# EAGLE design AutoISP328 (EAGLE 7.2.0)
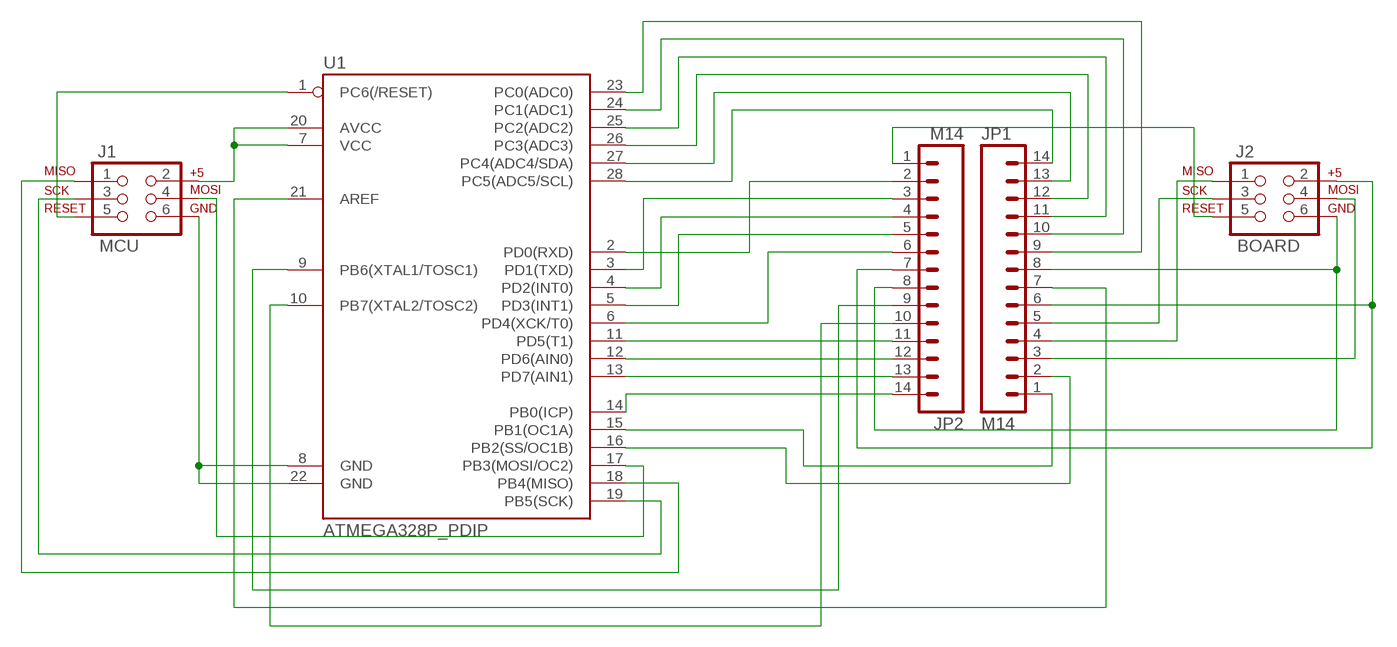
[diagram p0: schematic, sheet 1]

## Parts
J1  MCU  AVR_SPI_PRG_6PTH  [2X3]
J2  BOARD  AVR_SPI_PRG_6PTH  [2X3]
JP1  M14  [1X14]
JP2  M14  [1X14]
U1  ATMEGA328P_PDIP  [DIL28-3]

## Nets
N$1: J1.5 U1.1(PC6(/RESET))
N$2: J1.2 U1.7(VCC) U1.20(AVCC)
N$3: J1.6 U1.8(GND) U1.22(GND)
N$4: J1.4 U1.17(PB3(MOSI/OC2))
N$5: J1.1 U1.18(PB4(MISO))
N$6: J1.3 U1.19(PB5(SCK))
N$8: J2.3 JP1.5
N$9: J2.1 JP1.4
N$10: J2.6 JP1.8 JP2.8
N$11: JP1.14 U1.28(PC5(ADC5/SCL))
N$12: J2.4 JP1.3
N$13: J2.2 JP1.6 JP2.7
N$14: J2.5 JP2.1
N$15: JP1.7 U1.21(AREF)
N$16: JP2.9 U1.9(PB6(XTAL1/TOSC1))
N$17: JP2.10 U1.10(PB7(XTAL2/TOSC2))
N$18: JP1.13 U1.27(PC4(ADC4/SDA))
N$19: JP1.12 U1.26(PC3(ADC3))
N$20: JP1.11 U1.25(PC2(ADC2))
N$21: JP1.10 U1.24(PC1(ADC1))
N$22: JP1.9 U1.23(PC0(ADC0))
N$23: JP2.2 U1.2(PD0(RXD))
N$24: JP2.3 U1.3(PD1(TXD))
N$25: JP2.4 U1.4(PD2(INT0))
N$26: JP2.5 U1.5(PD3(INT1))
N$27: JP2.6 U1.6(PD4(XCK/T0))
N$28: JP2.11 U1.11(PD5(T1))
N$29: JP2.12 U1.12(PD6(AIN0))
N$30: JP2.13 U1.13(PD7(AIN1))
N$31: JP2.14 U1.14(PB0(ICP))
N$32: JP1.1 U1.15(PB1(OC1A))
N$33: JP1.2 U1.16(PB2(SS/OC1B))

## Library data of the parts
J1 J2 = SparkFun-Connectors:AVR_SPI_PRG_6: AVR ISP 6 Pin This is the reduced ISP connector for AVR programming. Common on Arduino. This footprint will take up less PCB space and can be used with a 10-pin to 6-pin adapter such as SKU: BOB-08508
JP1 JP2 = SparkFun-Connectors:M14: Header 14 Standard 14-pin 0.1" header. Use with straight break away headers (SKU : PRT-00116), right angle break away headers (PRT-00553), swiss pins (PRT-00743), machine pins (PRT-00117), and female headers (PRT-00115).
U1 = SparkFun-DigitalIC:ATMEGA328P_PDIP: uC used in the Arduino 32kb flash, 1k EEPROM, 2k SRAM This is the through-hole version of this chip.

## Board
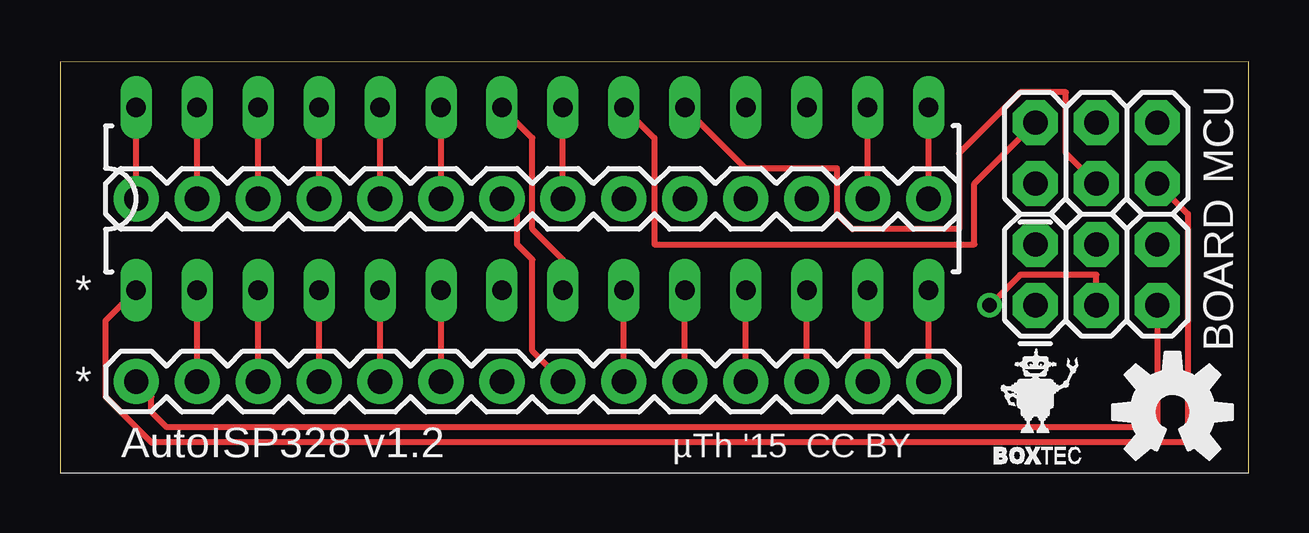
[diagram p1: board, top side]
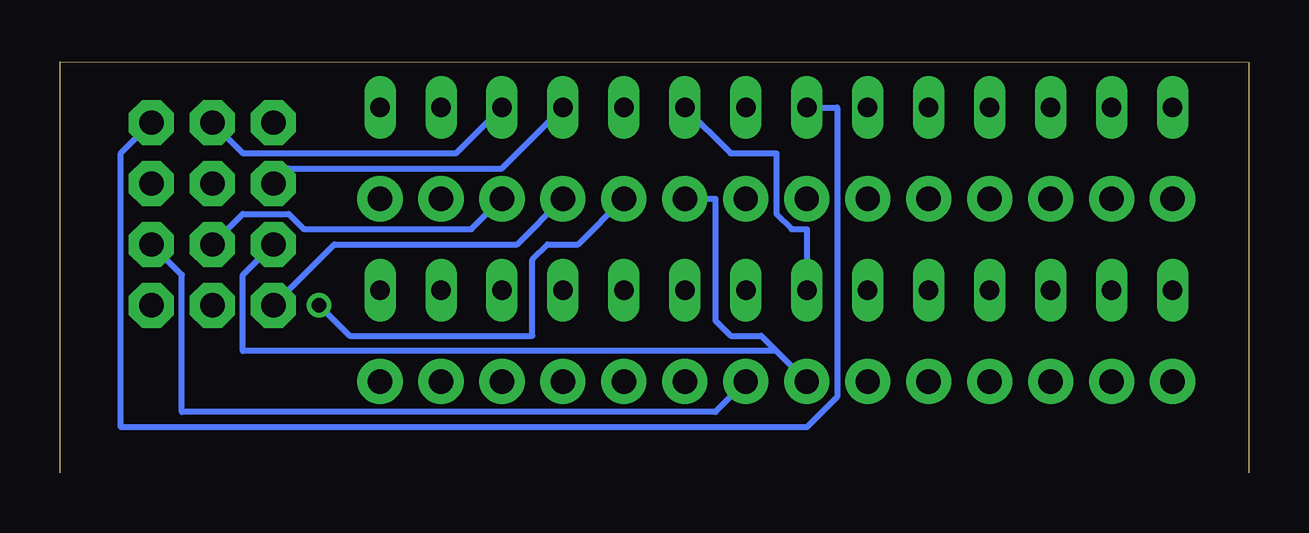
[diagram p2: board, bottom side, seen from below]

Size 49.53 x 17.14 mm. Coordinates in mm from the lower left corner, seen from the top.
Outline: 49.53,0 49.53,17.14 0,17.14 0,0
Copper layers (1*16): Top 0.035mm / dielectric 1.5mm / Bottom 0.035mm
Design rules "default": minimum track width 10mil, minimum drill 24mil, track to track 8mil, track to pad 8mil, pad to pad 8mil, via to via 8mil, smd to smd 8mil, copper to edge 40mil, drill to drill 8mil, minimum pad ring 10mil, minimum via ring 8mil, stop-mask expansion 4mil, vias tented up to drill 0mil, thermal gap 10mil

### Footprints (pad centres in the part's own frame; a part is rotated, then mirrored left to right if it is on the bottom)
2X3 = drill 1.016 pad 1.88 octagon: 1 0,0; 2 0,2.54; 3 2.54,0; 4 2.54,2.54; 5 5.08,0; 6 5.08,2.54
1X14 = drill 1.016 pad 1.88: 1 0,0; 2 2.54,0; 3 5.08,0; 4 7.62,0; 5 10.16,0; 6 12.7,0; 7 15.24,0; 8 17.78,0; 9 20.32,0; 10 22.86,0; 11 25.4,0; 12 27.94,0; 13 30.48,0; 14 33.02,0
DIL28-3 = drill 0.813 long: 1 -16.51,-3.81; 2 -13.97,-3.81; 3 -11.43,-3.81; 4 -8.89,-3.81; 5 -6.35,-3.81; 6 -3.81,-3.81; 7 -1.27,-3.81; 8 1.27,-3.81; 9 3.81,-3.81; 10 6.35,-3.81; 11 8.89,-3.81; 12 11.43,-3.81; 13 13.97,-3.81; 14 16.51,-3.81; 15 16.51,3.81; 16 13.97,3.81; 17 11.43,3.81; 18 8.89,3.81; 19 6.35,3.81; 20 3.81,3.81; 21 1.27,3.81; 22 -1.27,3.81; 23 -3.81,3.81; 24 -6.35,3.81; 25 -8.89,3.81; 26 -11.43,3.81; 27 -13.97,3.81; 28 -16.51,3.81

### Placement (x,y rotation side)
J1  40.64,12.06 0 top
J2  40.64,6.99 0 top
JP1  36.2,11.43 180 top
JP2  3.17,3.81 0 top
U1  19.68,11.43 0 top
U$1  [OSHW-LOGO-M]  46.35,2.54 0 top
U$2  [ROBOXTEC-VECLOGO-MICRO]  40.64,3.17 0 top

### Tracks (layer width: path | path; a pad name or v marks a point on that pad's centre or on a via)
N$1
  Top 0.254: U1.1 1.91,6.35 1.91,3.17 3.81,1.27 46.99,1.27 46.99,10.79 J1.5
N$2
  Top 0.254: J1.2 38.1,12.06 38.1,9.53 24.77,9.53 24.77,13.97 U1.20
  Bottom 0.254: U1.7 18.41,10.16 19.05,10.16 19.68,10.79 19.68,13.34 21.59,13.34 U1.20
N$3
  Top 0.254: U1.22 19.68,13.97 19.68,10.16 20.95,8.89 U1.8
  Bottom 0.254: J1.6 46.99,13.34 46.99,1.91 18.41,1.91 17.14,3.17 17.14,15.24 U1.22
N$4
  Bottom 0.254: U1.17 33.02,13.34 41.91,13.34 J1.4
N$5
  Bottom 0.254: U1.18 31.11,12.7 40.01,12.7 J1.1
N$6
  Top 0.254: U1.19 28.57,12.7 32.38,12.7 32.38,10.79 33.02,10.16 37.47,10.16 37.47,13.34 40.01,15.88 41.91,15.88 41.91,13.34 J1.3
N$8  (via drill 0.61)
  Top 0.254: v38.73,6.99 40.01,8.26 43.18,8.26 J2.3
  Bottom 0.254: JP1.5 27.94,9.53 29.21,9.53 29.84,8.89 29.84,5.71 37.47,5.71 v38.73,6.99
N$9
  Bottom 0.254: JP1.4 30.48,9.53 38.1,9.53 J2.1
N$10
  Top 0.254: JP1.8 19.05,10.79 19.05,9.53 19.68,8.89 19.68,5.08 JP2.8
  Bottom 0.254: J2.6 44.45,8.26 44.45,2.54 22.23,2.54 JP2.8
N$11
  Top 0.254: JP1.14 U1.28
N$12
  Bottom 0.254: JP1.3 32.38,10.16 39.37,10.16 40.01,10.79 41.91,10.79 J2.4
N$13
  Bottom 0.254: 19.68,5.08 20.32,5.71 21.59,5.71 22.23,6.35 22.23,11.43 JP1.6 | 19.68,5.08 JP2.7 | J2.2 41.91,8.26 41.91,5.08 19.68,5.08
N$14
  Top 0.254: JP2.1 3.81,3.17 3.81,2.54 4.45,1.91 45.72,1.91 J2.5
N$15
  Top 0.254: JP1.7 U1.21
N$16
  Top 0.254: JP2.9 U1.9
N$17
  Top 0.254: JP2.10 U1.10
N$18
  Top 0.254: JP1.13 U1.27
N$19
  Top 0.254: JP1.12 U1.26
N$20
  Top 0.254: JP1.11 U1.25
N$21
  Top 0.254: JP1.10 U1.24
N$22
  Top 0.254: JP1.9 U1.23
N$23
  Top 0.254: JP2.2 U1.2
N$24
  Top 0.254: JP2.3 U1.3
N$25
  Top 0.254: JP2.4 U1.4
N$26
  Top 0.254: JP2.5 U1.5
N$27
  Top 0.254: JP2.6 U1.6
N$28
  Top 0.254: JP2.11 U1.11
N$29
  Top 0.254: JP2.12 U1.12
N$30
  Top 0.254: JP2.13 U1.13
N$31
  Top 0.254: JP2.14 U1.14
N$32
  Top 0.254: JP1.1 U1.15
N$33
  Top 0.254: JP1.2 U1.16

### Text on the board
tNames: * | * | AutoISP328 v1.2 | µTh '15 CC BY